# EAGLE schematic Sunflower Schaltplan (EAGLE 9.7.0)
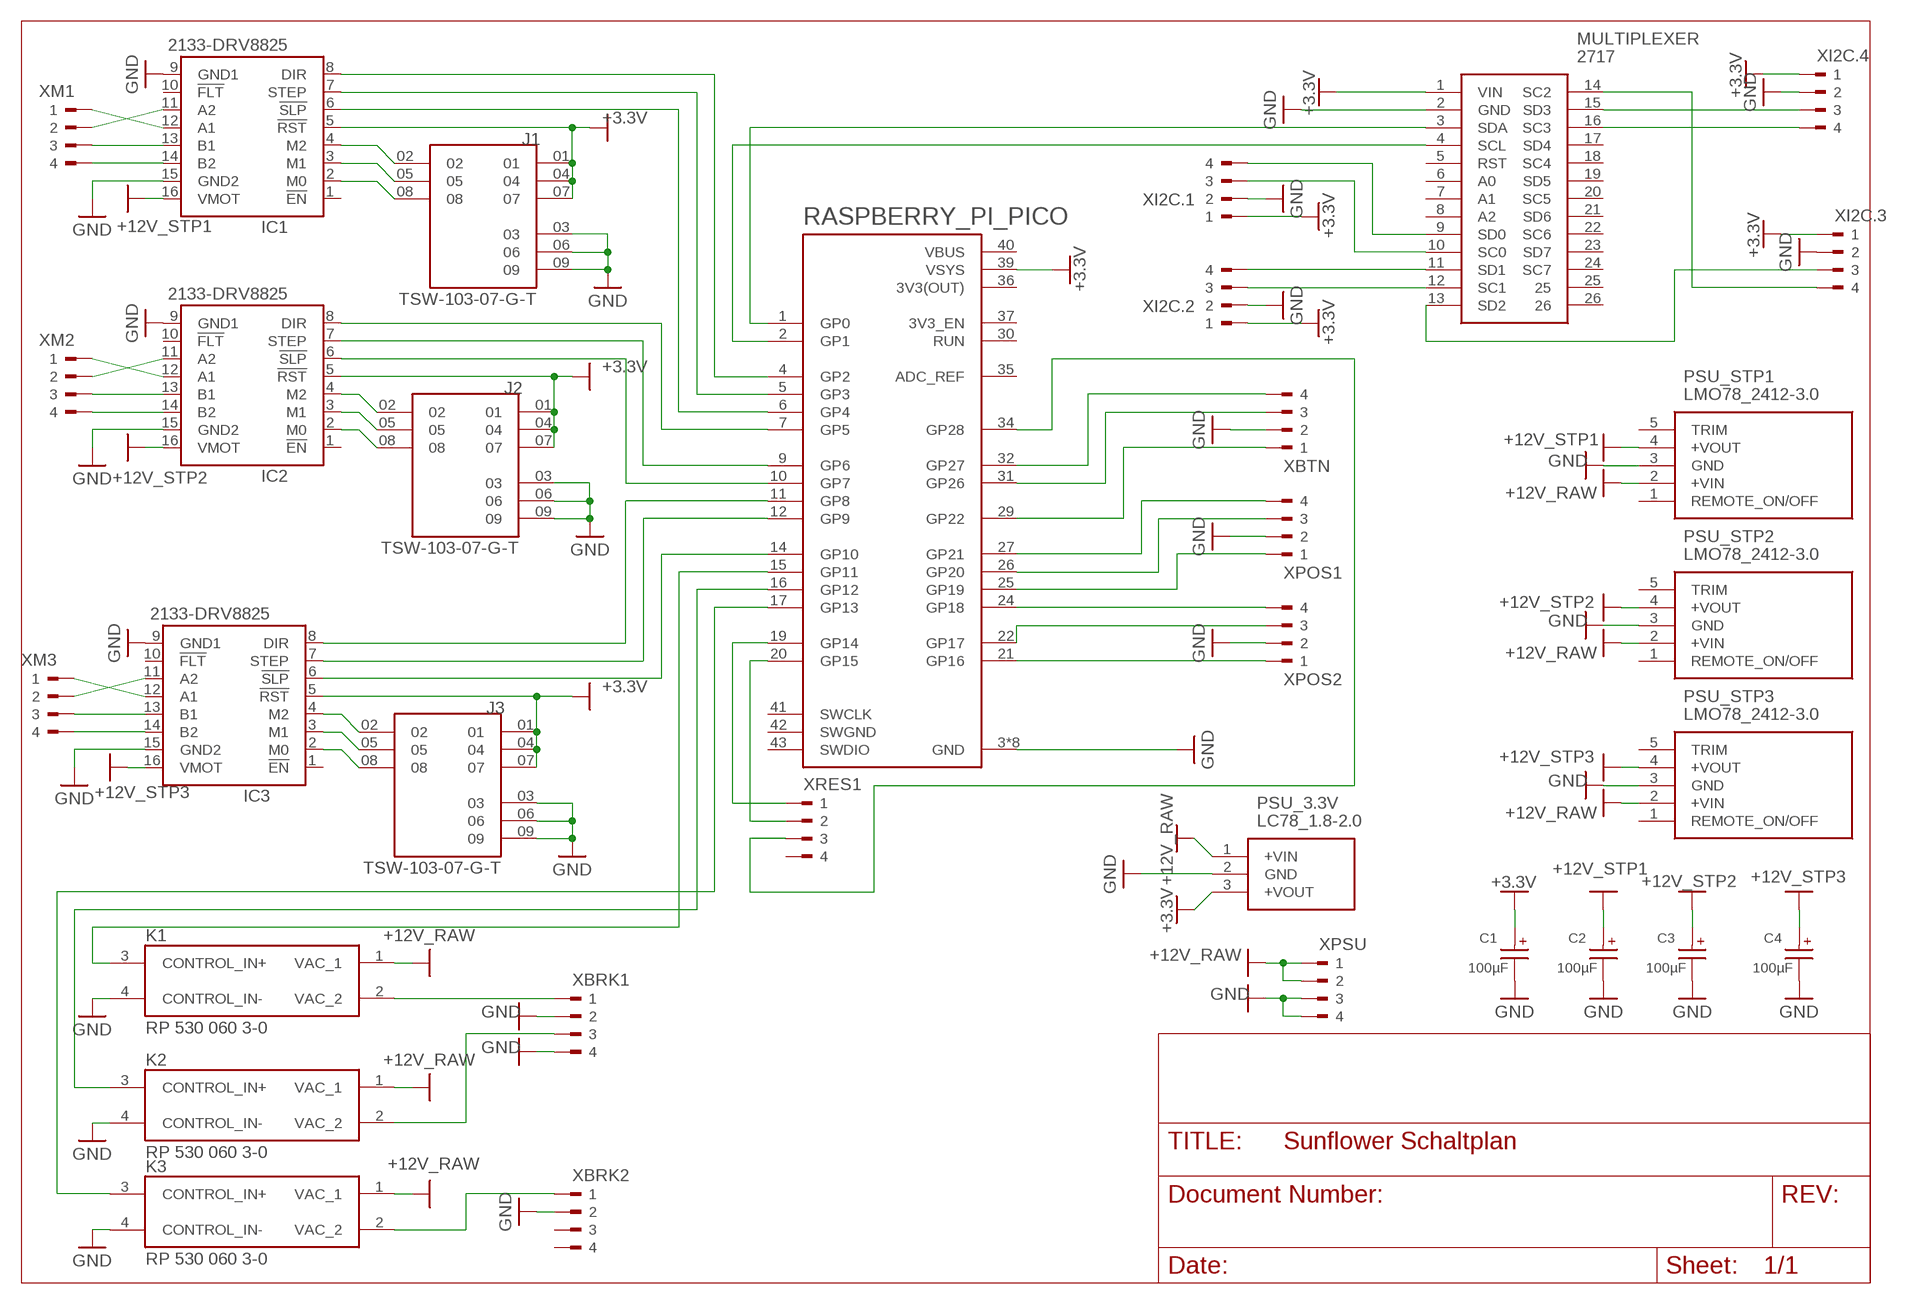
[diagram p0: schematic, sheet 1]

## Parts
C1  100µF  WCAP-ATET_10X16_860130275006  [WCAP-ATET_10X16(DXL)]
C2  100µF  WCAP-ATET_10X16_860130275006  [WCAP-ATET_10X16(DXL)]
C3  100µF  WCAP-ATET_10X16_860130275006  [WCAP-ATET_10X16(DXL)]
C4  100µF  WCAP-ATET_10X16_860130275006  [WCAP-ATET_10X16(DXL)]
IC1  2133-DRV8825  [DRV8825]
IC2  2133-DRV8825  [DRV8825]
IC3  2133-DRV8825  [DRV8825]
J1  TSW-103-07-G-T  [SAMTEC_TSW-103-07-G-T]
J2  TSW-103-07-G-T  [SAMTEC_TSW-103-07-G-T]
J3  TSW-103-07-G-T  [SAMTEC_TSW-103-07-G-T]
K1  RP 530 060 3-0  RP1A23D5  [RELAY_RP1A23D5]
K2  RP 530 060 3-0  RP1A23D5  [RELAY_RP1A23D5]
K3  RP 530 060 3-0  RP1A23D5  [RELAY_RP1A23D5]
MULTIPLEXER  2717  [2717]
PSU_3.3V  LC78_1.8-2.0  [LC78_1820]
PSU_STP1  LMO78_2412-3.0  [LMO78_241230]
PSU_STP2  LMO78_2412-3.0  [LMO78_241230]
PSU_STP3  LMO78_2412-3.0  [LMO78_241230]
RASPBERRY_PI_PICO  RASPBERRY_PICOTH  [PICO-PKG-TH]
XBRK1  ANLOX_PT09304HBBN  [ANLOX_PT09304HBBN]
XBRK2  ANLOX_PT09304HBBN  [ANLOX_PT09304HBBN]
XBTN  ANLOX_PT09304HBBN  [ANLOX_PT09304HBBN]
XI2C.1  ANLOX_PT09304HBBN  [ANLOX_PT09304HBBN]
XI2C.2  ANLOX_PT09304HBBN  [ANLOX_PT09304HBBN]
XI2C.3  ANLOX_PT09304HBBN  [ANLOX_PT09304HBBN]
XI2C.4  ANLOX_PT09304HBBN  [ANLOX_PT09304HBBN]
XM1  ANLOX_PT09304HBBN  [ANLOX_PT09304HBBN]
XM2  ANLOX_PT09304HBBN  [ANLOX_PT09304HBBN]
XM3  ANLOX_PT09304HBBN  [ANLOX_PT09304HBBN]
XPOS1  ANLOX_PT09304HBBN  [ANLOX_PT09304HBBN]
XPOS2  ANLOX_PT09304HBBN  [ANLOX_PT09304HBBN]
XPSU  ANLOX_PT09304HBBN  [ANLOX_PT09304HBBN]
XRES1  ANLOX_PT09304HBBN  [ANLOX_PT09304HBBN]

## Nets
+3.3V: C1.1(+) IC1.5(!RST) IC2.5(!RST) IC3.5(!RST) J1.01 J1.04 J1.07 J2.01 J2.04 J2.07 J3.01 J3.04 J3.07 MULTIPLEXER.1(VIN) PSU_3.3V.3(+VOUT) RASPBERRY_PI_PICO.39(VSYS) XI2C.1.1 XI2C.2.1 XI2C.3.1 XI2C.4.1
+12V_RAW: K1.1(VAC_1) K2.1(VAC_1) K3.1(VAC_1) PSU_3.3V.1(+VIN) PSU_STP1.2(+VIN) PSU_STP2.2(+VIN) PSU_STP3.2(+VIN) XPSU.1 XPSU.2
+12V_STP1: C2.1(+) IC1.16(VMOT) PSU_STP1.4(+VOUT)
+12V_STP2: C3.1(+) IC2.16(VMOT) PSU_STP2.4(+VOUT)
+12V_STP3: C4.1(+) IC3.16(VMOT) PSU_STP3.4(+VOUT)
GND: C1.2(-) C2.2(-) C3.2(-) C4.2(-) IC1.9(GND1) IC1.15(GND2) IC2.9(GND1) IC2.15(GND2) IC3.9(GND1) IC3.15(GND2) J1.03 J1.06 J1.09 J2.03 J2.06 J2.09 J3.03 J3.06 J3.09 K1.4(CONTROL_IN-) K2.4(CONTROL_IN-) K3.4(CONTROL_IN-) MULTIPLEXER.2(GND) PSU_3.3V.2(GND) PSU_STP1.3(GND) PSU_STP2.3(GND) PSU_STP3.3(GND) RASPBERRY_PI_PICO.3(GND) RASPBERRY_PI_PICO.8(GND) RASPBERRY_PI_PICO.13(GND) RASPBERRY_PI_PICO.18(GND) RASPBERRY_PI_PICO.23(GND) RASPBERRY_PI_PICO.28(GND) RASPBERRY_PI_PICO.33(GND) RASPBERRY_PI_PICO.38(GND) XBRK1.2 XBRK1.4 XBRK2.2 XBTN.2 XI2C.1.2 XI2C.2.2 XI2C.3.2 XI2C.4.2 XPOS1.2 XPOS2.2 XPSU.3 XPSU.4
N$1: MULTIPLEXER.3(SDA) RASPBERRY_PI_PICO.1(GP0)
N$2: MULTIPLEXER.4(SCL) RASPBERRY_PI_PICO.2(GP1)
N$3: IC1.12(A1) XM1.1
N$4: IC1.11(A2) XM1.2
N$5: IC1.13(B1) XM1.3
N$6: IC1.14(B2) XM1.4
N$7: IC2.12(A1) XM2.1
N$8: IC2.11(A2) XM2.2
N$9: IC2.13(B1) XM2.3
N$10: IC2.14(B2) XM2.4
N$11: IC3.12(A1) XM3.1
N$12: IC3.11(A2) XM3.2
N$13: IC3.13(B1) XM3.3
N$14: IC3.14(B2) XM3.4
N$15: IC1.8(DIR) RASPBERRY_PI_PICO.4(GP2)
N$16: IC2.8(DIR) RASPBERRY_PI_PICO.7(GP5)
N$17: IC3.8(DIR) RASPBERRY_PI_PICO.11(GP8)
N$18: IC1.7(STEP) RASPBERRY_PI_PICO.5(GP3)
N$19: IC2.7(STEP) RASPBERRY_PI_PICO.9(GP6)
N$20: IC1.4(M2) J1.02
N$21: RASPBERRY_PI_PICO.29(GP22) XBTN.1
N$22: RASPBERRY_PI_PICO.31(GP26) XBTN.3
N$23: RASPBERRY_PI_PICO.32(GP27) XBTN.4
N$24: MULTIPLEXER.9(SD0) XI2C.1.4
N$25: MULTIPLEXER.10(SC0) XI2C.1.3
N$26: MULTIPLEXER.11(SD1) XI2C.2.4
N$27: MULTIPLEXER.12(SC1) XI2C.2.3
N$28: MULTIPLEXER.13(SD2) XI2C.3.3
N$29: MULTIPLEXER.15(SD3) XI2C.4.3
N$30: MULTIPLEXER.14(SC2) XI2C.3.4
N$31: MULTIPLEXER.16(SC3) XI2C.4.4
N$32: RASPBERRY_PI_PICO.21(GP16) XPOS2.1
N$33: RASPBERRY_PI_PICO.22(GP17) XPOS2.3
N$34: RASPBERRY_PI_PICO.24(GP18) XPOS2.4
N$35: RASPBERRY_PI_PICO.25(GP19) XPOS1.1
N$36: RASPBERRY_PI_PICO.26(GP20) XPOS1.3
N$37: RASPBERRY_PI_PICO.27(GP21) XPOS1.4
N$39: K1.3(CONTROL_IN+) RASPBERRY_PI_PICO.15(GP11)
N$40: K2.3(CONTROL_IN+) RASPBERRY_PI_PICO.16(GP12)
N$41: K3.3(CONTROL_IN+) RASPBERRY_PI_PICO.17(GP13)
N$42: K3.2(VAC_2) XBRK2.1
N$43: RASPBERRY_PI_PICO.20(GP15) XRES1.2
N$44: RASPBERRY_PI_PICO.19(GP14) XRES1.1
N$45: IC3.6(!SLP) RASPBERRY_PI_PICO.14(GP10)
N$46: IC2.6(!SLP) RASPBERRY_PI_PICO.10(GP7)
N$47: K1.2(VAC_2) XBRK1.1
N$48: K2.2(VAC_2) XBRK1.3
N$49: IC1.6(!SLP) RASPBERRY_PI_PICO.6(GP4)
N$51: RASPBERRY_PI_PICO.34(GP28) XRES1.3
N$52: IC1.3(M1) J1.05
N$53: IC3.7(STEP) RASPBERRY_PI_PICO.12(GP9)
N$54: IC1.2(M0) J1.08
N$55: IC2.4(M2) J2.02
N$56: IC2.3(M1) J2.05
N$57: IC2.2(M0) J2.08
N$58: IC3.4(M2) J3.02
N$59: IC3.3(M1) J3.05
N$60: IC3.2(M0) J3.08
Unconnected: IC1.1(!EN) IC1.10(!FLT) IC2.1(!EN) IC2.10(!FLT) IC3.1(!EN) IC3.10(!FLT) MULTIPLEXER.5(RST) MULTIPLEXER.6(A0) MULTIPLEXER.7(A1) MULTIPLEXER.8(A2) MULTIPLEXER.17(SD4) MULTIPLEXER.18(SC4) MULTIPLEXER.19(SD5) MULTIPLEXER.20(SC5) MULTIPLEXER.21(SD6) MULTIPLEXER.22(SC6) MULTIPLEXER.23(SD7) MULTIPLEXER.24(SC7) MULTIPLEXER.25 MULTIPLEXER.26 PSU_STP1.1(REMOTE_ON/OFF) PSU_STP1.5(TRIM) PSU_STP2.1(REMOTE_ON/OFF) PSU_STP2.5(TRIM) PSU_STP3.1(REMOTE_ON/OFF) PSU_STP3.5(TRIM) RASPBERRY_PI_PICO.30(RUN) RASPBERRY_PI_PICO.35(ADC_REF) RASPBERRY_PI_PICO.37(3V3_EN) RASPBERRY_PI_PICO.41(SWCLK) RASPBERRY_PI_PICO.43(SWDIO) XBRK2.3 XBRK2.4 XRES1.4

## Power pins joined to a net without a drawn wire
3V3(OUT): RASPBERRY_PI_PICO.36(3V3(OUT))
SWGND: RASPBERRY_PI_PICO.42(SWGND)
VBUS: RASPBERRY_PI_PICO.40(VBUS)

## Library data of the parts
C1-C4 = Wurth_Capacitors_WCAP-ATET:WCAP-ATET_10X16: WCAP-ATET Aluminium Electrolytic Capacitors High Temperature +125 °C Characteristics High operating temperature product series Mounting style: THT Radial Capacitance range: 0.47 µF ‒ 1000 µF Capacitance tolerance: ±20 % Voltage range (UR): 10 ‒ 350 V(DC) Operating temperature: -40 °C up to +125 °C for UR ≤100 V(DC) -25 °C up to +125 °C for UR >100 V(DC) Endurance: 1000 ‒ 2000 h @ +125 °C Dimensions (DxL) in mm: 5.0 x 11.0 up to 16.0 x 31.5 Recommended soldering: Wave soldering Applications High operating temperature applications Filtering Smoothing Energy storage Coupling e.g. Switched-mode power supply, AC/DC converter, adapter, charger, digital camera <https://www.we-online.com/catalog/media/o14728v209%20Family_WCAP-ATET.jpg> Details see: https://www.we-online.com/catalog/en/WCAP-ATET/ Updated by yingchun,Shan;2020-02-28 2020(C) Würth Elektronik; DATASHEET-URL: https://www.we-online.com/catalog/datasheet/860130275006.pdf; DF: 18%; DIAMETER: 10mm; I-LEAK: 100uA; I-RIPPLE: 870mA; L: 16mm; OPERATING-TEMPERATURE: -40 °C up to +125 °C; PART-NUMBER: 860130275006; PITCH: 5mm; TECHNICAL-REFERENCE: ATGF160102M010DSPAAB000; VALUE: 1000 µF; VR: 10V(DC)
IC1-IC3 = pololu-stepper-driver:2133-DRV8825: DRV8825 Stepper Motor Driver Carrier, High Current #2133 DRV8825 Stepper Motor Driver Carrier; High Current <https://www.pololu.com/product/2133> in Japan, Suzaku Lab. Ltd. <https://suzakugiken.jp/> #2133 DRV8825 大電流用ステッピングモータドライバ <https://szc.jp/po2133>
J1-J3 = TSW-103-07-G-T:TSW-103-07-G-T: Check availability <https://pricing.snapeda.com/parts/TSW-103-07-G-T/Samtec%20Inc./view-part?ref=eda>; AVAILABILITY: In Stock; CHECK_PRICES: https://www.snapeda.com/parts/TSW-103-07-G-T/Samtec+Inc./view-part/?ref=eda; DESCRIPTION: TSW - Samtec 2.54mm Pin Header 10.92mm Overall Pin Length (07) - Fast Stock; MF: Samtec Inc.; MP: TSW-103-07-G-T; PACKAGE: None; PRICE: None; PURCHASE-URL: https://www.snapeda.com/api/url_track_click_mouser/?unipart_id=3309796&manufacturer=Samtec Inc.&part_name=TSW-103-07-G-T&search_term=tsw-103-07-g-t; SNAPEDA_LINK: https://www.snapeda.com/parts/TSW-103-07-G-T/Samtec+Inc./view-part/?ref=snap
K1-K3 = RP1A23D5:RP1A23D5: Check availability <https://pricing.snapeda.com/parts/RP1A23D5/Carlo%20Gavazzi%20Inc./view-part?ref=eda>; AVAILABILITY: In Stock; CHECK_PRICES: https://www.snapeda.com/parts/RP1A23D5/Carlo+Gavazzi+Inc./view-part/?ref=eda; DESCRIPTION: Solid State Relay PC Pin PCB Mount Zero Crossing 5 A 32 V dc | Carlo Gavazzi Inc. RP1A23D5; MF: Carlo Gavazzi Inc.; MP: RP1A23D5; PACKAGE: SIP-4 Carlo Gavazzi Inc.; PRICE: None; PURCHASE-URL: https://www.snapeda.com/api/url_track_click_mouser/?unipart_id=3647319&manufacturer=Carlo Gavazzi Inc.&part_name=RP1A23D5&search_term=None; SNAPEDA_LINK: https://www.snapeda.com/parts/RP1A23D5/Carlo+Gavazzi+Inc./view-part/?ref=snap
MULTIPLEXER = TCA9548A_m:2717: Switch IC Development Tools TCA9548A I2C Multiplexer Source: Datasheet <https://learn.adafruit.com/downloads/pdf/adafruit-tca9548a-1-to-8-i2c-multiplexer-breakout.pdf>; DESCRIPTION: Switch IC Development Tools TCA9548A I2C Multiplexer; HEIGHT: 1mm; MANUFACTURER_NAME: Adafruit; MANUFACTURER_PART_NUMBER: 2717; MOUSER_PART_NUMBER: 485-2717; MOUSER_PRICE-STOCK: https://www.mouser.com/Search/Refine.aspx?Keyword=485-2717
PSU_3.3V = LC78_1.8-2.0:LC78_1.8-2.0: Non-Isolated PoL Module DC DC Converter 1 Output 1.8V 2A 4.5V - 30V Input Source: Datasheet <https://gaptec-electronic.com/datenblaetter/LC78_2.0.pdf>; DESCRIPTION: Non-Isolated PoL Module DC DC Converter 1 Output 1.8V 2A 4.5V - 30V Input; HEIGHT: 10.45mm; MANUFACTURER_NAME: Gaptec; MANUFACTURER_PART_NUMBER: LC78_03-2.0
PSU_STP1-PSU_STP3 = LMO78_2412-3.0:LMO78_2412-3.0: Wide Input Non-Isolated & Regulated, Single Positive/Negative Output, Output Voltage= 5 ~ 15VDC, Output Current=3A, Input Voltage=24VDC, Capacitive load=500F Source: Datasheet <https://gaptec-electronic.com/datenblaetter/LMO78_3.0.pdf>; DESCRIPTION: Wide Input Non-Isolated & Regulated, Single Positive/Negative Output, Output Voltage= 5 ~ 15VDC, Output Current=3A, Input Voltage=24VDC, Capacitive load=500F; HEIGHT: 17mm; MANUFACTURER_NAME: Gaptec; MANUFACTURER_PART_NUMBER: LMO78_2412-3.0
RASPBERRY_PI_PICO = RpiPico:RASPBERRY_PICO: Raspberry Pi Pico
XBRK1 XBRK2 XBTN XI2C.1-XI2C.4 XM1-XM3 XPOS1 XPOS2 XPSU XRES1 = Metz Connect:ANLOX_PT09304HBBN